# Altium project BullCoolerShield.PrjPCB
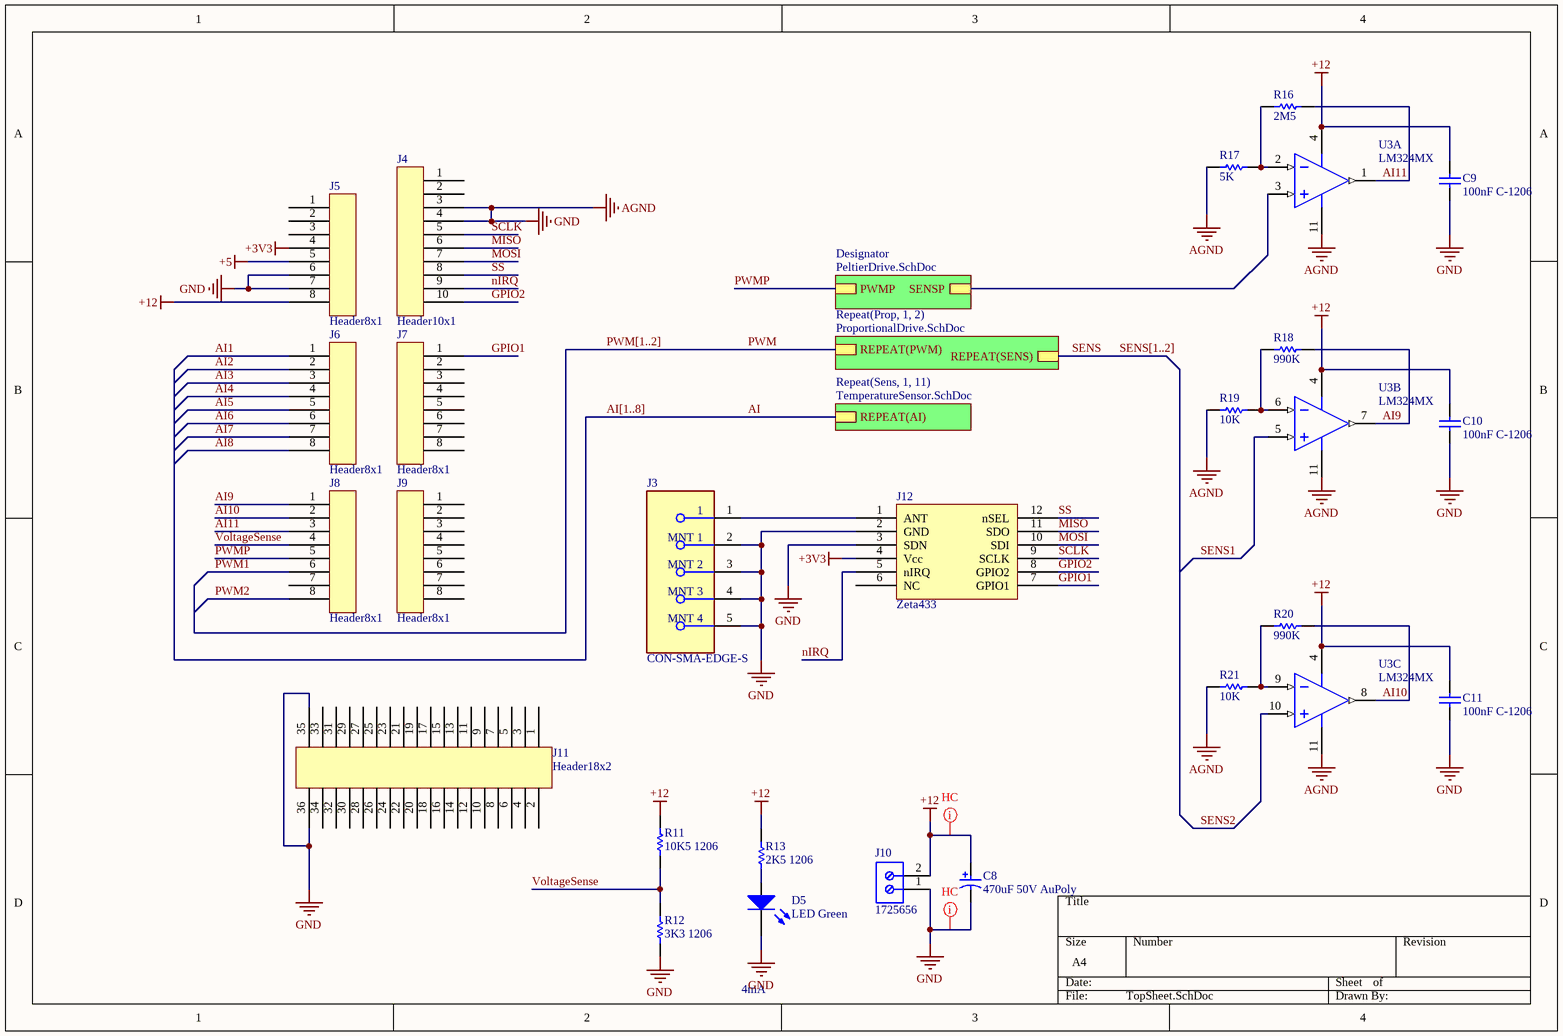
[diagram p0: TopSheet.SchDoc]
4 sheets, 100 parts. Net scope: hierarchical (ports join the sheet entries above them; power ports are global).
Board file: BullCoolerShield.PcbDoc
Sheets:
  TopSheet.SchDoc
    Designator = PeltierDrive.SchDoc
    Prop1 = ProportionalDrive.SchDoc
    Prop2 = ProportionalDrive.SchDoc
    Sens1 = TemperatureSensor.SchDoc
    Sens2 = TemperatureSensor.SchDoc
    Sens3 = TemperatureSensor.SchDoc
    Sens4 = TemperatureSensor.SchDoc
    Sens5 = TemperatureSensor.SchDoc
    Sens6 = TemperatureSensor.SchDoc
    Sens7 = TemperatureSensor.SchDoc
    Sens8 = TemperatureSensor.SchDoc
    Sens9 = TemperatureSensor.SchDoc
    Sens10 = TemperatureSensor.SchDoc
    Sens11 = TemperatureSensor.SchDoc

## Sheet TopSheet.SchDoc
size A4

### Parts
C8  470uF 50V AuPoly  [CAPAE137130X163M]
C9  100nF C-1206  [C-1206]
C10  100nF C-1206  [C-1206]
C11  100nF C-1206  [C-1206]
D5  LED Green  [0603_A]
J3  CON-SMA-EDGE-S  [FP-CON-SMA-EDGE-S-MFG]
J4  Header10x1  [Header10x1]
J5  Header8x1  [Header8x1]
J6  Header8x1  [Header8x1]
J7  Header8x1  [Header8x1]
J8  Header8x1  [Header8x1]
J9  Header8x1  [Header8x1]
J10  1725656  [PHOE-1725656-2]
J11  Header18x2  [Header18x2]
J12  Zeta433  [Zeta433-SM]
R11  10K5 1206  [R-1206]
R12  3K3 1206  [R-1206]
R13  2K5 1206  [R-1206]
R16  2M5  [RESC0603(1608)_N]
R17  5K  [RESC0603(1608)_N]
R18  990K  [RESC0603(1608)_N]
R19  10K  [RESC0603(1608)_N]
R20  990K  [RESC0603(1608)_N]
R21  10K  [RESC0603(1608)_N]
U3  LM324MX  [D0014A_L]  (parts A,B,C of 4)

### Sub-sheets
Designator = PeltierDrive.SchDoc: PWMP, SENSP
Repeat(Prop, 1, 2) = ProportionalDrive.SchDoc: REPEAT(PWM), REPEAT(SENS)
Repeat(Sens, 1, 11) = TemperatureSensor.SchDoc: REPEAT(AI)

### Nets
+3V3: J5.4 J12.4(Vcc)
+5: J5.5
+12: C8.1 C9.2 C10.2 C11.2 J5.8 J10.2 R11.2 R13.2 U3.4(V+)
AGND: C8.2 C9.1 C10.1 C11.1 D5.1(K) J3.2(MNT_1) J3.3(MNT_2) J3.4(MNT_3) J3.5(MNT_4) J4.3 J4.4 J5.6 J5.7 J10.1 J11.35 J11.36 J12.2(GND) J12.3(SDN) R12.1 R17.1 R19.1 R21.1 U3.11(GND)  [also labelled GND]
AI: sheet Repeat(Sens, 1, 11)/REPEAT(AI)
AI1: J6.1
AI2: J6.2
AI3: J6.3
AI4: J6.4
AI5: J6.5
AI6: J6.6
AI7: J6.7
AI8: J6.8
AI9: J8.1 R18.2 U3.7(OUT2)
AI10: J8.2 R20.2 U3.8(OUT3)
AI11: J8.3 R16.2 U3.1(OUT1)
GPIO1: J7.1 J12.7(GPIO1)
GPIO2: J4.10 J12.8(GPIO2)
MISO: J4.6 J12.11(SDO)
MOSI: J4.7 J12.10(SDI)
nIRQ: J4.9 J12.5(nIRQ)
PWM: sheet Repeat(Prop, 1, 2)/REPEAT(PWM)
PWM1: J8.6
PWM2: J8.8
PWMP: J8.5 ; sheet Designator/PWMP
SCLK: J4.5 J12.9(SCLK)
SENS: sheet Repeat(Prop, 1, 2)/REPEAT(SENS)
SENS1: U3.5(IN2+)
SENS2: U3.10(IN3+)
SS: J4.8 J12.12(nSEL)
VoltageSense: J8.4 R11.1 R12.2
NetD5_2: D5.2(A) R13.1
NetJ1_1: U3.3(IN1+) ; sheet Designator/SENSP
NetJ3_1: J3.1 J12.1(ANT)
NetR16_1: R16.1 R17.2 U3.2(IN1-)
NetR18_1: R18.1 R19.2 U3.6(IN2-)
NetR20_1: R20.1 R21.2 U3.9(IN3-)

Not connected (* = marked no-connect by the designer): J4 1 2; J5 1 2 3; J7 2 3 4 5 6 7 8; J8 7; J9 1 2 3 4 5 6 7 8; J11 1 2 3 4 5 6 7 8 9 10 11 12 13 14 15 16 17 18 19 20 21 22 23 24 25 26 27 28 29 30 31 32 33 34; J12 6(NC)

### Buses and harness runs
bus AI[1..8]
bus PWM[1..2]
bus SENS[1..2]

### Layout directives
net class HC: +12, AGND

### Notes on the sheet
- 4mA

### Library data of the parts
C8 = C-Poly: Manufacturer: AVX; DELETED: Compliant; Product Depth (mm): 4.3mm; Product Length (mm): 7.3mm; Case Style: Molded; Product Diameter (mm): NotRequiredmm; DF: 6%; Seal: NotRequired; Capacitance: 22000000pF; Product Height (mm): 2.9mm; Rad Hardened: No; ESR: 0.2ohm; Polarity: Polar; DCL: 5.5uA; Voltage: 25VDC; Tolerance (+ or -): 10%; Construction: SMTChip; Mounting Style: SurfaceMount; Packaging: TapeandReel; Case Code: D; Package Reference: 7343-31; Manufacturer URL: http://www.avx.com/; Failure Rate: NotRequired; Insulation: NotRequired; Operating Temp Range: -55Cto125C; Mounting Technology: SurfaceMount; Package Description: 2-Pin Surface Mount Device, Body 7.3 x 4.35 mm; Length W/Weld (max): NotRequiredmm; Lead Spacing (nom): NotRequiredmm; Seated Plane Height: NotRequiredmm; Wire Form: NotRequired; Datasheet Version: 02/2004; Datasheet URL: https://datasheet.ciiva.com/11793/0900766b80066cb4-11793194.pdf; Length W/Weld: NotRequiredmm; Package / Case: 7343-31
C9-C11 = C-1206: Ceramic 50V 1206; Case-EIA: 1206; Tolerance: Â±20%; Case-Metric: 3216; Max Thickness: 1 mm; Rated Voltage: 50 V; Value: 100nF; Technology: SMT
D5 = CMP-1426-00002-1: SMD mono-color Chip LED, WL-SMCW, Green; PartNumber: 150060GS75000; Manufacturer: Wuerth Elektronik; ComponentLink1URL: http://www.we-online.com; ComponentLink2Description: Datasheet; Color: Green; ComponentLink2URL: http://katalog.we-online.com/led/datasheet/150060GS75000.pdf; PackageReference: 0603_A; ComponentLink1Description: Manufacturer URL
J3 = CMP-204357-000001-1: CONN SMA JACK STR EDGE MNT; Manufacturer: RF Solutions Ltd.; Impedance: 50Ω; Conn Orientation: Right Angle; Is Female: yes; Number Of Contacts: 1; Frequency: 18GHz; Shielding: true; Category: Conn; ComponentLink2URL: https://www.rfsolutions.co.uk/downloads/1498648656DS-CON-EDGE-SMA-4.pdf; Octopart: https://octopart.com/con-sma-edge-s-rf+solutions-70967450; Package: CONN_JACK; Manufacturer Part Number: CON-SMA-EDGE-S; Height: 6.35mm; Device Class L1: Connectors; Footprint Url: https://forum.upverter.com/uploads/default/original/3X/b/e/be75b907af57498775929d6d9099689c472e0307.pdf; Contact Material: Gold; ComponentLink2Description: Datasheet; Device Class L2: RF / Coaxial Connectors; RoHS: TRUE; Device Class L3: unset; Digikey Description: CONN SMA JACK STR EDGE MNT; Lead Free: Yes; Automotive: No
J10 = CMP-2000-05299-1: Male Header, Pitch 2.54 mm, 1 x 2 Position, Height 9 mm, Tail Length 3.5 mm; Manufacturer: Phoenix Contact; Number of contacts: 2; Content: 250pc(s); Pitch: 2.54mm; Industrial packaging: Yes; Colour: Green; Manufacturer part No.: 1725656; Type: MPT0,5/2-2,54; Datasheet URL: http://datasheet.octopart.com/1725656-Phoenix-Contact-datasheet-5302866.pdf; Manufacturer URL: http://www.phoenixcontact.com/; Datasheet Version: Apr-08
R11-R13 = R-1206: 0.25W 1206; Power: 0.1 W; Value: 10000.00 Ohm; Tolerance: 1 %; Case-EIA: 0603; Case-Metric: 1608; Technology: SMT
R16-R21 = CMP-1012-00623-1: 10K 0.1W 1% 0603 (1608 Metric)  SMD; Value: 10000.00 Ohm; Case-EIA: 0603; Case-Metric: 1608; Power: 0.1 W; Tolerance: 1 %; Technology: SMT
U3 = CMP-0055-00741-3: Low Power Quad Operational Amplifier, 14-pin Narrow SOIC; Manufacturer: Texas Instruments; PowerWise: N; CompType: Amplifiers; PackageTopMarking: NSUZXYTTE#*LM324M; Package Reference: D0014A; ComponentLink1URL: http://www.ti.com/general/docs/lit/getliterature.tsp?genericPartNumber=LM324-N&fileType=pdf; PinCount: 14; PackageDescription: Molded Package S.O., .150in Wide, 14 Lead; Code_JEDEC: MS-012AB; Code_IPC: SOIC127P600-14; ComponentLink1Description: Datasheet URL; RoHS: N

## Sheet PeltierDrive.SchDoc
size A4
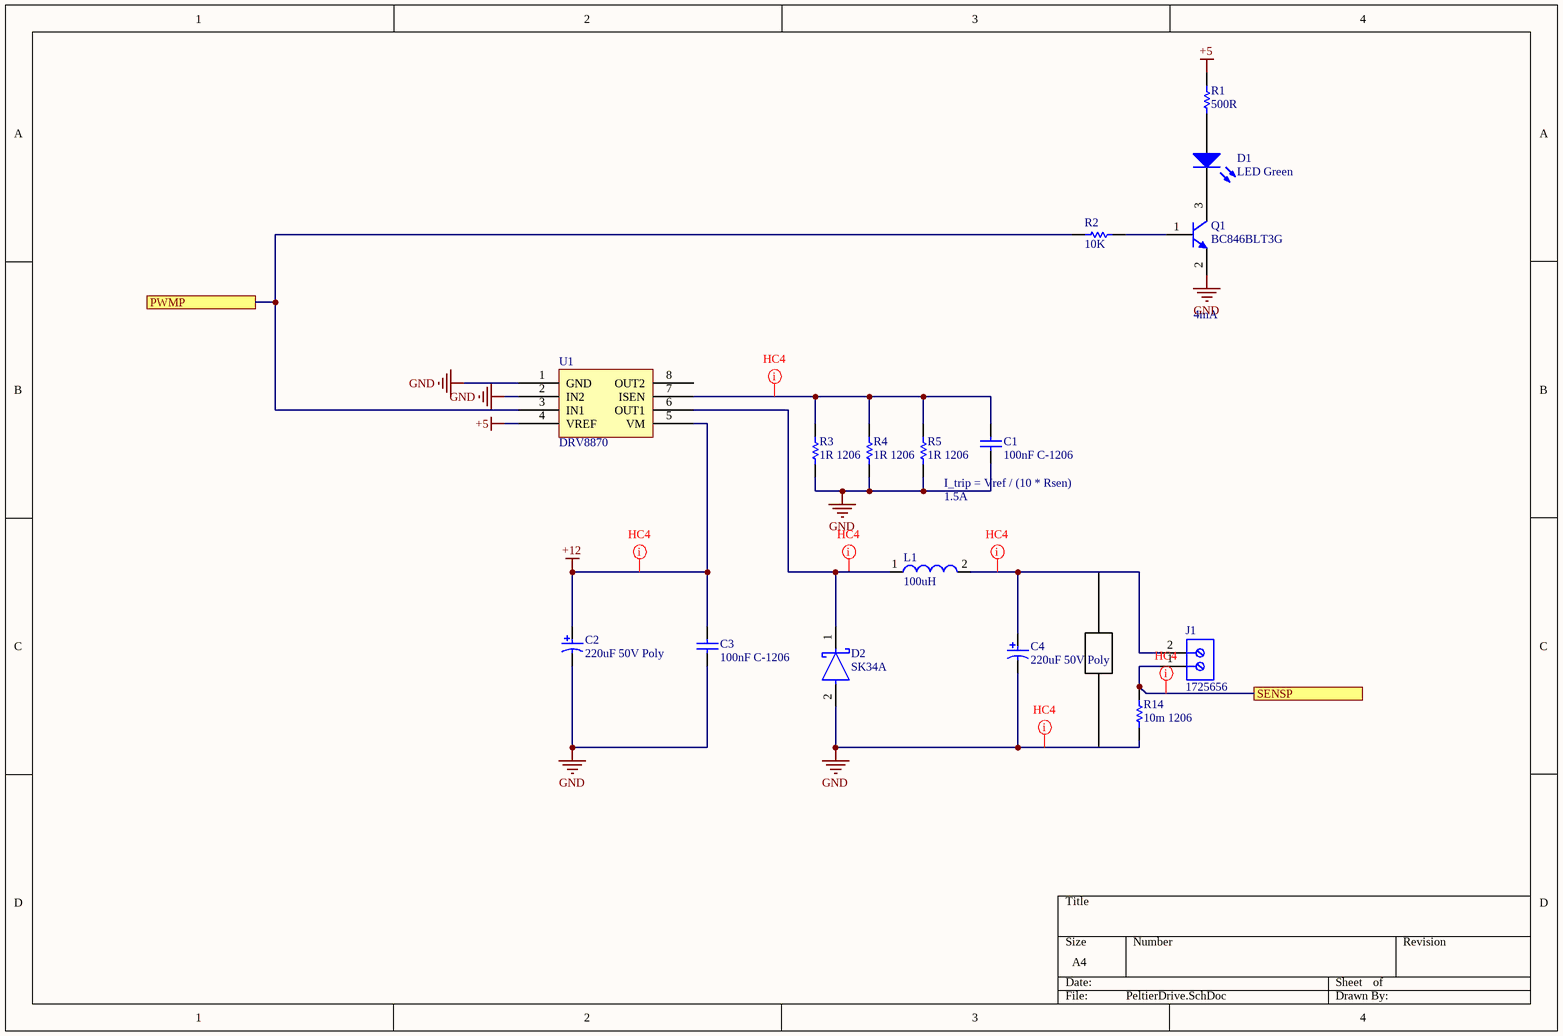
[diagram p1: PeltierDrive.SchDoc]

### Parts
C1  100nF C-1206  [C-1206]
C2  220uF 50V Poly  [CAPAE127P600-8N]
C3  100nF C-1206  [C-1206]
C4  220uF 50V Poly  [CAPAE127P600-8N]
D1  LED Green  [0603_A]
D2  SK34A  [FP-DO-214AC-MFG]
J1  1725656  [PHOE-1725656-2]
L1  100uH  [INDC177172X70N]
Q1  BC846BLT3G  [ONSC-SOT-23-3-318-08_V]
R1  500R  [RESC0603(1608)_L]
R2  10K  [RESC0603(1608)_N]
R3  1R 1206  [RESC1206(3216)_N]
R4  1R 1206  [RESC1206(3216)_N]
R5  1R 1206  [RESC1206(3216)_N]
R14  10m 1206  [RESC1206(3216)_N]
U1  DRV8870  [SOIC127P600X170_HS-9N]

### Ports
PWMP, SENSP

### Nets
+5: R1.2 U1.4(VREF)
+12: C2.1 C3.2 U1.5(VM)
GND: C1.1 C2.2 C3.1 C4.2 D2.2(A) Q1.2(E) R3.1 R4.1 R5.1 R14.1 U1.1(GND) U1.2(IN2)  [project net AGND]
PWMP: R2.1 U1.3(IN1) ; port PWMP
NetC1_2: C1.2 R3.2 R4.2 R5.2 U1.7(ISEN)
NetC4_1: C4.1 J1.2 L1.2
NetD1_1: D1.1(K) Q1.3(C)
NetD1_2: D1.2(A) R1.1
NetD2_1: D2.1(C) L1.1 U1.6(OUT1)
NetJ1_1: J1.1 R14.2 ; port SENSP
NetQ1_1: Q1.1(B) R2.2

Not connected (* = marked no-connect by the designer): U1 8(OUT2)

### Layout directives
net class HC4: +12, AGND, NetC1_2, NetC4_1, NetD2_1, NetJ1_1

### Notes on the sheet
- 4mA
- I_trip = Vref / (10 * Rsen)
- 1.5A

### Library data of the parts
C1 C3 = C-1206: as C9 on sheet TopSheet; Max Thickness: 1 mm; Rated Voltage: 50 V; Value: 100nF; Technology: SMT
C2 C4 = C-Poly: as C8 on sheet TopSheet; Construction: SMTChip; Mounting Style: SurfaceMount; Packaging: TapeandReel; Case Code: D; Package Reference: 7343-31; Manufacturer URL: http://www.avx.com/; Failure Rate: NotRequired; Insulation: NotRequired; Operating Temp Range: -55Cto125C; Mounting Technology: SurfaceMount; Package Description: 2-Pin Surface Mount Device, Body 7.3 x 4.35 mm; Length W/Weld (max): NotRequiredmm; Lead Spacing (nom): NotRequiredmm; Seated Plane Height: NotRequiredmm; Wire Form: NotRequired; Datasheet Version: 02/2004; Datasheet URL: https://datasheet.ciiva.com/11793/0900766b80066cb4-11793194.pdf; Length W/Weld: NotRequiredmm; Package / Case: 7343-31
D1 = CMP-1426-00002-1: as D5 on sheet TopSheet; ComponentLink1URL: http://www.we-online.com; ComponentLink2Description: Datasheet; Color: Green; ComponentLink2URL: http://katalog.we-online.com/led/datasheet/150060GS75000.pdf; PackageReference: 0603_A; ComponentLink1Description: Manufacturer URL
D2 = CMP-56206-000004-1: DIODE SCHOTTKY 5A 30V SMA; Mount: Surface Mount; Max Reverse Voltage (DC): 30V; Case/Package: SMA; Packaging: Tape and Reel; Average Rectified Current: 5A
J1 = CMP-2000-05299-1: as J10 on sheet TopSheet; Colour: Green; Manufacturer part No.: 1725656; Type: MPT0,5/2-2,54; Datasheet URL: http://datasheet.octopart.com/1725656-Phoenix-Contact-datasheet-5302866.pdf; Manufacturer URL: http://www.phoenixcontact.com/; Datasheet Version: Apr-08
L1 = Inductor1717: PA4344.104NLT / https://products.pulseelex.com/files/product_files/P771.pdf; Manufacturer: Wuerth Elektronik; PartNumber: 74479763215; Inductance: 1.50 ÂµH; ComponentLink1Description: Manufacturer URL; PackageReference: SMD 0603_A; ComponentLink1URL: http://www.we-online.com; ComponentLink2URL: http://katalog.we-online.de/kataloge/eisos/media/pdf/74479763215.pdf; ComponentLink2Description: Datasheet
Q1 = CMP-1048-00780-1: General Purpose Transistor, NPN Silicon, 3-Pin SOT-23, Pb-Free, Tape and Reel; Manufacturer: On Semiconductor; fT Min (MHz): 100; IC Continuous (A): 0.1; ComponentLink2Description: Datasheet; Packing: Tape and Reel; Mounting Technology: Surface Mount; Polarity: NPN; PackageDescription: 3-Pin Small Outline Transistor, Body 2.92 x 1.3 mm, Pitch 0.95 mm; ComponentLink1Description: Manufacturer URL; PackageVersion: Rev. AP, 11/2009; ComponentLink3Description: Package Specification; ComponentLink3URL: http://www.onsemi.cn/pub_link/Collateral/318-08.PDF; PartNumber: BC846BLT3G; RoHS: TRUE; ComponentLink2URL: http://www.onsemi.cn/pub_link/Collateral/BC846ALT1-D.PDF; PackageReference: SOT-23-3-318-08; DatasheetVersion: Rev. 11; ComponentLink1URL: http://www.onsemi.com/
R1 = CMP-1012-00067-1: 510R 0.1W 5% 0603 (1608 Metric)  SMD; Case-EIA: 0603; Value: 510.00 Ohm; Case-Metric: 1608; Technology: SMT; Power: 0.1 W; Tolerance: 5 %
R2 = CMP-1012-00623-1: as R16 on sheet TopSheet; Power: 0.1 W; Tolerance: 1 %; Technology: SMT
R3-R5 R14 = CMP-1014-00004-1: 1R2 0.25W 5% 1206 (3216 Metric)  SMD; Value: 1.20 Ohm; Case-Metric: 3216; Case-EIA: 1206; Power: 0.25 W; Technology: SMT; Tolerance: 5 %

## Sheet ProportionalDrive.SchDoc
size A4
Used 2 times, as channels Prop1, Prop2. Parts and nets are listed once, with the designators drawn on the sheet.
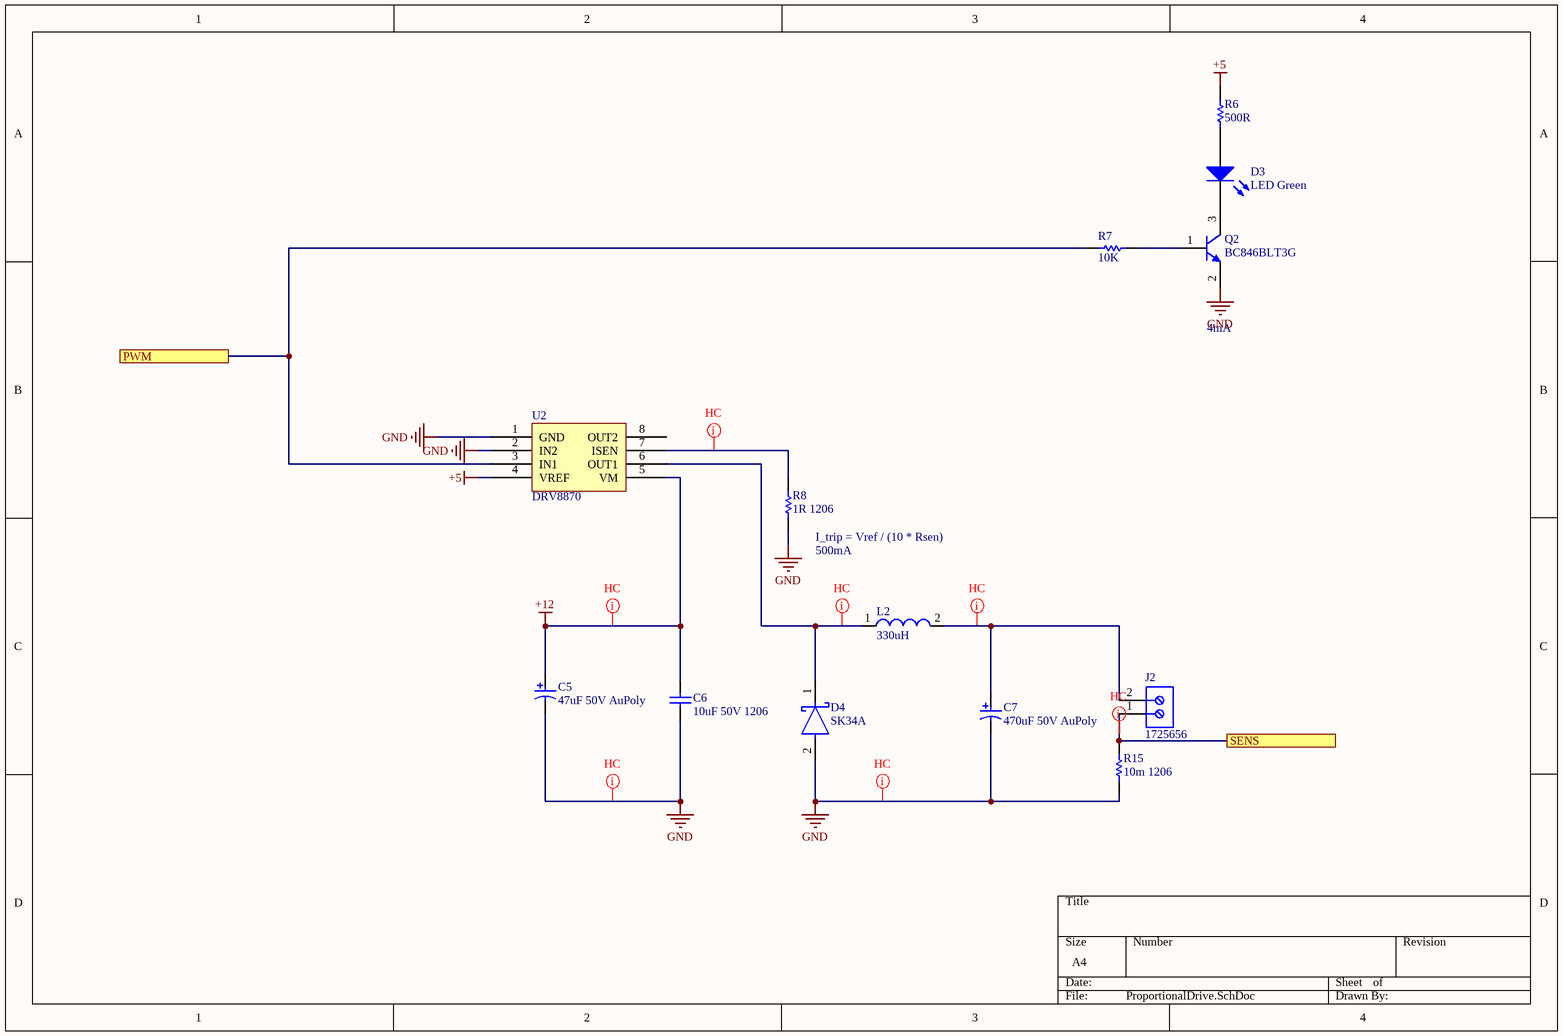
[diagram p2: ProportionalDrive.SchDoc]

### Parts
C5  47uF 50V AuPoly  [EEH-ZA1H220P]
C6  10uF 50V 1206  [CAPC1206(3216)190_N]
C7  470uF 50V AuPoly  [CAPAE137130X163M]
D3  LED Green  [0603_A]
D4  SK34A  [FP-DO-214AC-MFG]
J2  1725656  [PHOE-1725656-2]
L2  330uH  [L1212]
Q2  BC846BLT3G  [ONSC-SOT-23-3-318-08_V]
R6  500R  [RESC0603(1608)_L]
R7  10K  [RESC0603(1608)_N]
R8  1R 1206  [RESC1206(3216)_N]
R15  10m 1206  [RESC1206(3216)_N]
U2  DRV8870  [SOIC127P600X170_HS-9N]

### Ports
PWM, SENS

### Nets
+5: R6.2 U2.4(VREF)
+12: C5.1 C6.2 U2.5(VM)
GND: C5.2 C6.1 C7.2 D4.2(A) Q2.2(E) R8.1 R15.1 U2.1(GND) U2.2(IN2)
PWM: R7.1 U2.3(IN1) ; port PWM
SENS: J2.1 R15.2 ; port SENS
NetC7_1: C7.1 J2.2 L2.2
NetD3_1: D3.1(K) Q2.3(C)
NetD3_2: D3.2(A) R6.1
NetD4_1: D4.1(C) L2.1 U2.6(OUT1)
NetQ2_1: Q2.1(B) R7.2
NetR8_2: R8.2 U2.7(ISEN)

Not connected (* = marked no-connect by the designer): U2 8(OUT2)

### Channels
Prop1: designators end in _Prop1; ports PWM=PWM1 SENS=SENS1
Prop2: designators end in _Prop2; ports PWM=PWM2 SENS=SENS2

### Layout directives
net class HC: +12, AGND, NetC7_Prop1_1, NetD4_Prop1_1, NetR8_Prop1_2, SENS1

### Notes on the sheet
- 4mA
- (near R8) I_trip = Vref / (10 * Rsen)
- (near R8) 500mA

### Library data of the parts
C5 C7 = C-Poly: as C8 on sheet TopSheet; Construction: SMTChip; Mounting Style: SurfaceMount; Packaging: TapeandReel; Case Code: D; Package Reference: 7343-31; Manufacturer URL: http://www.avx.com/; Failure Rate: NotRequired; Insulation: NotRequired; Operating Temp Range: -55Cto125C; Mounting Technology: SurfaceMount; Package Description: 2-Pin Surface Mount Device, Body 7.3 x 4.35 mm; Length W/Weld (max): NotRequiredmm; Lead Spacing (nom): NotRequiredmm; Seated Plane Height: NotRequiredmm; Wire Form: NotRequired; Datasheet Version: 02/2004; Datasheet URL: https://datasheet.ciiva.com/11793/0900766b80066cb4-11793194.pdf; Length W/Weld: NotRequiredmm; Package / Case: 7343-31
C6 = CMP-1037-04983-1: CAP 10uF 50V ±20% 1206 (3216 Metric) Thickness 1.9mm SMD; Tolerance: Â±20%; Case-Metric: 3216; Case-EIA: 1206; Technology: SMT; Max Thickness: 1.9 mm; Rated Voltage: 50 V; Value: 10uF
D3 = CMP-1426-00002-1: as D5 on sheet TopSheet; ComponentLink1URL: http://www.we-online.com; ComponentLink2Description: Datasheet; Color: Green; ComponentLink2URL: http://katalog.we-online.com/led/datasheet/150060GS75000.pdf; PackageReference: 0603_A; ComponentLink1Description: Manufacturer URL
D4 = CMP-56206-000004-1: DIODE SCHOTTKY 5A 30V SMA; Mount: Surface Mount; Max Reverse Voltage (DC): 30V; Case/Package: SMA; Packaging: Tape and Reel; Average Rectified Current: 5A
J2 = CMP-2000-05299-1: as J10 on sheet TopSheet; Colour: Green; Manufacturer part No.: 1725656; Type: MPT0,5/2-2,54; Datasheet URL: http://datasheet.octopart.com/1725656-Phoenix-Contact-datasheet-5302866.pdf; Manufacturer URL: http://www.phoenixcontact.com/; Datasheet Version: Apr-08
L2 = Inductor1212: Manufacturer: Wuerth Elektronik; PartNumber: 74479763215; Inductance: 1.50 ÂµH; ComponentLink1Description: Manufacturer URL; PackageReference: SMD 0603_A; ComponentLink1URL: http://www.we-online.com; ComponentLink2URL: http://katalog.we-online.de/kataloge/eisos/media/pdf/74479763215.pdf; ComponentLink2Description: Datasheet
Q2 = CMP-1048-00780-1: as Q1 on sheet PeltierDrive; ComponentLink2Description: Datasheet; Packing: Tape and Reel; Mounting Technology: Surface Mount; Polarity: NPN; PackageDescription: 3-Pin Small Outline Transistor, Body 2.92 x 1.3 mm, Pitch 0.95 mm; ComponentLink1Description: Manufacturer URL; PackageVersion: Rev. AP, 11/2009; ComponentLink3Description: Package Specification; ComponentLink3URL: http://www.onsemi.cn/pub_link/Collateral/318-08.PDF; PartNumber: BC846BLT3G; RoHS: TRUE; ComponentLink2URL: http://www.onsemi.cn/pub_link/Collateral/BC846ALT1-D.PDF; PackageReference: SOT-23-3-318-08; DatasheetVersion: Rev. 11; ComponentLink1URL: http://www.onsemi.com/
R6 = CMP-1012-00067-1: as R1 on sheet PeltierDrive; Technology: SMT; Power: 0.1 W; Tolerance: 5 %
R7 = CMP-1012-00623-1: as R16 on sheet TopSheet; Power: 0.1 W; Tolerance: 1 %; Technology: SMT
R8 R15 = CMP-1014-00004-1: as R3 on sheet PeltierDrive; Power: 0.25 W; Technology: SMT; Tolerance: 5 %

## Sheet TemperatureSensor.SchDoc
size A4
Used 11 times, as channels Sens1, Sens2, Sens3, Sens4, Sens5, Sens6, Sens7, Sens8, Sens9, Sens10, Sens11. Parts and nets are listed once, with the designators drawn on the sheet.
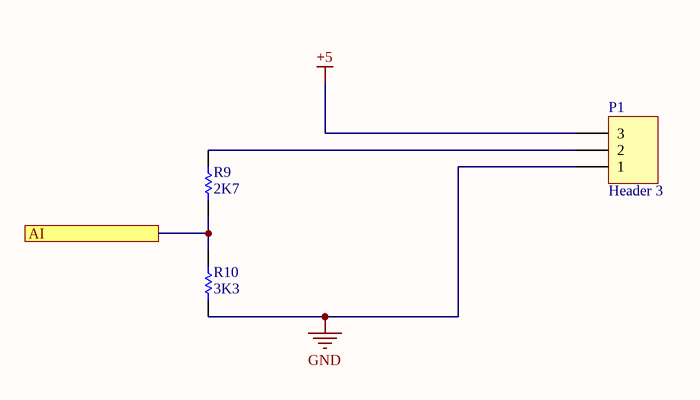
[diagram p3: TemperatureSensor.SchDoc]

### Parts
P1  Header 3  [HDR1X3]
R9  2K7  [RESC0603(1608)_N]
R10  3K3  [RESC0603(1608)_N]

### Ports
AI

### Nets
+5: P1.3
GND: P1.1 R10.1
AI: R9.1 R10.2 ; port AI
NetP1_2: P1.2 R9.2

### Channels
Sens1: designators end in _Sens1; ports AI=AI1
Sens2: designators end in _Sens2; ports AI=AI2
Sens3: designators end in _Sens3; ports AI=AI3
Sens4: designators end in _Sens4; ports AI=AI4
Sens5: designators end in _Sens5; ports AI=AI5
Sens6: designators end in _Sens6; ports AI=AI6
Sens7: designators end in _Sens7; ports AI=AI7
Sens8: designators end in _Sens8; ports AI=AI8
Sens9: designators end in _Sens9; ports AI=AI9
Sens10: designators end in _Sens10; ports AI=AI10
Sens11: designators end in _Sens11; ports AI=AI11

### Library data of the parts
P1 = Header 3: Header, 3-Pin; LatestRevisionDate: 17-Jul-2002; LatestRevisionNote: Re-released for DXP Platform.; Publisher: Altium Limited
R9 R10 = CMP-1012-00623-1: as R16 on sheet TopSheet; Power: 0.1 W; Tolerance: 1 %; Technology: SMT

## Nets that join several sheets
+5: TopSheet (J5.5), PeltierDrive (R1.2 U1.4), Prop1 (R6_Prop1.2 U2_Prop1.4), Prop2 (R6_Prop2.2 U2_Prop2.4), Sens1 (P1_Sens1.3), Sens2 (P1_Sens2.3), Sens3 (P1_Sens3.3), Sens4 (P1_Sens4.3), Sens5 (P1_Sens5.3), Sens6 (P1_Sens6.3), Sens7 (P1_Sens7.3), Sens8 (P1_Sens8.3), Sens9 (P1_Sens9.3), Sens10 (P1_Sens10.3), Sens11 (P1_Sens11.3)
+12: TopSheet (9 pins), PeltierDrive (C2.1 C3.2 U1.5), Prop1 (C5_Prop1.1 C6_Prop1.2 U2_Prop1.5), Prop2 (C5_Prop2.1 C6_Prop2.2 U2_Prop2.5)
AGND: TopSheet (23 pins), PeltierDrive (12 pins), Prop1 (9 pins), Prop2 (9 pins), Sens1 (P1_Sens1.1 R10_Sens1.1), Sens2 (P1_Sens2.1 R10_Sens2.1), Sens3 (P1_Sens3.1 R10_Sens3.1), Sens4 (P1_Sens4.1 R10_Sens4.1), Sens5 (P1_Sens5.1 R10_Sens5.1), Sens6 (P1_Sens6.1 R10_Sens6.1), Sens7 (P1_Sens7.1 R10_Sens7.1), Sens8 (P1_Sens8.1 R10_Sens8.1), Sens9 (P1_Sens9.1 R10_Sens9.1), Sens10 (P1_Sens10.1 R10_Sens10.1), Sens11 (P1_Sens11.1 R10_Sens11.1)
AI1: TopSheet (J6.1), Sens1 (R9_Sens1.1 R10_Sens1.2)
AI2: TopSheet (J6.2), Sens2 (R9_Sens2.1 R10_Sens2.2)
AI3: TopSheet (J6.3), Sens3 (R9_Sens3.1 R10_Sens3.2)
AI4: TopSheet (J6.4), Sens4 (R9_Sens4.1 R10_Sens4.2)
AI5: TopSheet (J6.5), Sens5 (R9_Sens5.1 R10_Sens5.2)
AI6: TopSheet (J6.6), Sens6 (R9_Sens6.1 R10_Sens6.2)
AI7: TopSheet (J6.7), Sens7 (R9_Sens7.1 R10_Sens7.2)
AI8: TopSheet (J6.8), Sens8 (R9_Sens8.1 R10_Sens8.2)
AI9: TopSheet (J8.1 R18.2 U3.7), Sens9 (R9_Sens9.1 R10_Sens9.2)
AI10: TopSheet (J8.2 R20.2 U3.8), Sens10 (R9_Sens10.1 R10_Sens10.2)
AI11: TopSheet (J8.3 R16.2 U3.1), Sens11 (R9_Sens11.1 R10_Sens11.2)
NetJ1_1: TopSheet (U3.3), PeltierDrive (J1.1 R14.2)
PWM1: TopSheet (J8.6), Prop1 (R7_Prop1.1 U2_Prop1.3)
PWM2: TopSheet (J8.8), Prop2 (R7_Prop2.1 U2_Prop2.3)
PWMP: TopSheet (J8.5), PeltierDrive (R2.1 U1.3)
SENS1: TopSheet (U3.5), Prop1 (J2_Prop1.1 R15_Prop1.2)
SENS2: TopSheet (U3.10), Prop2 (J2_Prop2.1 R15_Prop2.2)